# EAGLE design sumoboard (EAGLE 7.4.0)
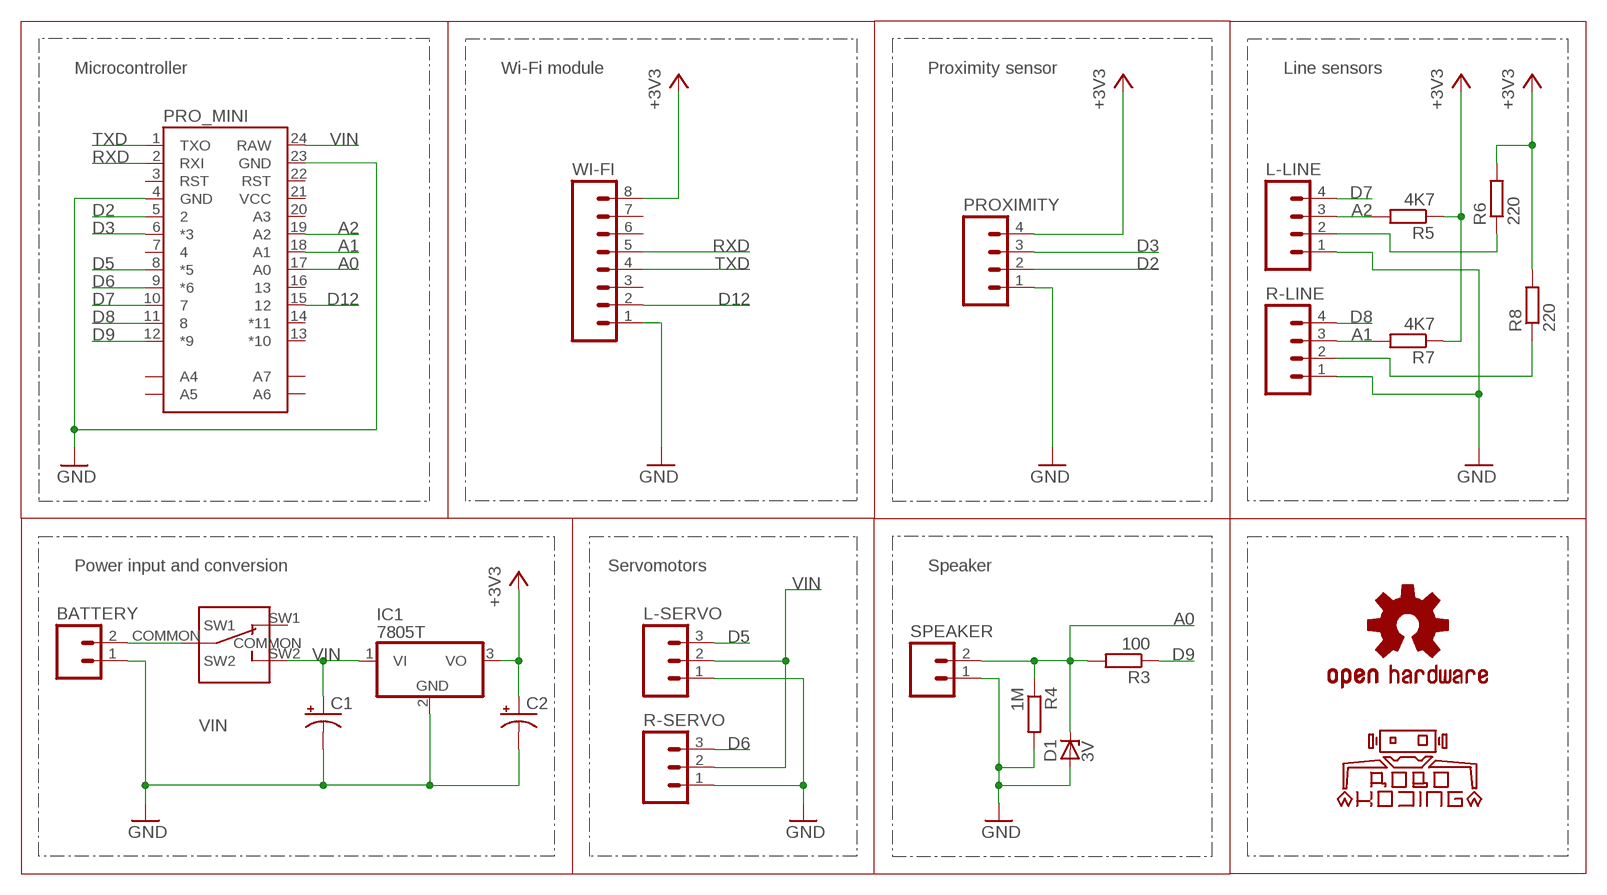
[diagram p0: schematic, sheet 1]

## Parts
BATTERY  M02LOCK_LONGPADS  [1X02_LOCK_LONGPADS]
C1  CPOL-USE5-10.5  [E5-10,5]
C2  CPOL-USE5-10.5  [E5-10,5]
D1  3V  1N821  [DO35Z10]
IC1  7805T  [TO220H]
L-LINE  M04LOCK_LONGPADS  [1X04_LOCK_LONGPADS]
L-SERVO  M03LOCK_LONGPADS  [1X03_LOCK_LONGPADS]
LOGO1  OSHW-LOGOM  [OSHW-LOGO-M]
LOGO2  ROBOKODING-LOGOM  [ROBOKODING-LOGO-M]
POWER  SPDT_SLIDE_SWITCH  [SPDT_SLIDE_SWITCH]
PRO_MINI  ARDUINO_PRO_MINI  [ARDUINO_PRO_MINI]
PROXIMITY  M04LOCK_LONGPADS  [1X04_LOCK_LONGPADS]
R3  100  R-EU_0204/5  [0204/5]
R4  1M  R-EU_0204/5  [0204/5]
R5  4K7  R-EU_0204/5  [0204/5]
R6  220  R-EU_0204/5  [0204/5]
R7  4K7  R-EU_0204/5  [0204/5]
R8  220  R-EU_0204/5  [0204/5]
R-LINE  M04LOCK_LONGPADS  [1X04_LOCK_LONGPADS]
R-SERVO  M03LOCK_LONGPADS  [1X03_LOCK_LONGPADS]
SPEAKER  M02LOCK_LONGPADS  [1X02_LOCK_LONGPADS]
WI-FI  M08LOCK_LONGPADS  [1X08_LOCK_LONGPADS]

## Nets
+3V3: C2.+ IC1.3(VO) PROXIMITY.4 R5.1 R6.2 R7.1 R8.2 WI-FI.8
A0: D1.C PRO_MINI.17(A0) R3.2 R4.1 SPEAKER.2
A1: PRO_MINI.18(A1) R7.2 R-LINE.3
A2: L-LINE.3 PRO_MINI.19(A2) R5.2
BAT_IN: BATTERY.2 POWER.COMMON
D2: PRO_MINI.5 PROXIMITY.2
D3: PRO_MINI.6(*3) PROXIMITY.3
D5: L-SERVO.3 PRO_MINI.8(*5)
D6: PRO_MINI.9(*6) R-SERVO.3
D7: L-LINE.4 PRO_MINI.10
D8: PRO_MINI.11 R-LINE.4
D9: PRO_MINI.12(*9) R3.1
D12: PRO_MINI.15 WI-FI.2
GND: BATTERY.1 C1.- C2.- D1.A IC1.2(GND) L-LINE.1 L-SERVO.1 PRO_MINI.4(GND) PRO_MINI.23(GND) PROXIMITY.1 R4.2 R-LINE.1 R-SERVO.1 SPEAKER.1 WI-FI.1
N$6: L-LINE.2 R6.1
N$7: R8.1 R-LINE.2
RXD: PRO_MINI.2(RXI) WI-FI.5
TXD: PRO_MINI.1(TXO) WI-FI.4
VIN: C1.+ IC1.1(VI) L-SERVO.2 POWER.SW2 PRO_MINI.24(RAW) R-SERVO.2
Unconnected: POWER.SW1 PRO_MINI.3(RST) PRO_MINI.7 PRO_MINI.13(*10) PRO_MINI.14(*11) PRO_MINI.16 PRO_MINI.20(A3) PRO_MINI.21(VCC) PRO_MINI.22(RST) WI-FI.3 WI-FI.6 WI-FI.7

## Notes on the sheet
- Microcontroller | Wi-Fi module | Proximity sensor | Line sensors
- Power input and conversion | Servomotors | Speaker

## Library data of the parts
BATTERY SPEAKER = SparkFun-Connectors:M02: Standard 2-pin 0.1" header. Use with - straight break away headers ( PRT-00116) - right angle break away headers (PRT-00553) - swiss pins (PRT-00743) - machine pins (PRT-00117) - female headers (PRT-00115) Molex polarized connector foot print use with: PRT-08233 with associated crimp pins and housings. 2.54_SCREWTERM for use with PRT-10571. 3.5mm Screw Terminal footprints for PRT-08084 5mm Screw Terminal footprints for use with PRT-08432
C1 C2 = rcl:CPOL-US: POLARIZED CAPACITOR, American symbol
D1 = diode:1N821: Reference DIODE temperature compensated, 6,2 V
IC1 = linear:78*: Positive VOLTAGE REGULATOR Source: http://cache.national.com/ds/LM/LM78L05.pdf http://www.fairchildsemi.com/ds/LM/LM7805.pdf
L-LINE PROXIMITY R-LINE = SparkFun-Connectors:M04: Header 4 Standard 4-pin 0.1" header. Use with straight break away headers (SKU : PRT-00116), right angle break away headers (PRT-00553), swiss pins (PRT-00743), machine pins (PRT-00117), and female headers (PRT-00115). Molex polarized connector foot print use with SKU : PRT-08231 with associated crimp pins and housings. 1MM SMD Version SKU: PRT-10208
L-SERVO R-SERVO = SparkFun-Connectors:M03: Header 3 Standard 3-pin 0.1" header. Use with straight break away headers (SKU : PRT-00116), right angle break away headers (PRT-00553), swiss pins (PRT-00743), machine pins (PRT-00117), and female headers (PRT-00115). Molex polarized connector foot print use with SKU : PRT-08232 with associated crimp pins and housings.
LOGO1 = SparkFun-Aesthetics:OSHW-LOGO: Open Source Hardware Logo This logo indicates the piece of hardware it is found on incorporates a OSHW license and/or adheres to the definition of open source hardware found here: http://freedomdefined.org/OSHW
LOGO2 = robokoding-logo:ROBOKODING-LOGO: Robokoding logo This logo indicates that the piece of hardware was developed by the RoboKoding community. RoboKoding is a organisation that focuses on teaching everyone building and programming robots: http://www.robokoding.com
POWER = custom:SPDT_SLIDE_SWITCH
PRO_MINI = SparkFun-Boards:ARDUINO_PRO_MINI
R3-R8 = Child-Friendly-Parts:R-EU_: RESISTOR, European symbol
WI-FI = SparkFun-Connectors:M08: Header 8 Standard 8-pin 0.1" header. Use with straight break away headers (SKU : PRT-00116), right angle break away headers (PRT-00553), swiss pins (PRT-00743), machine pins (PRT-00117), and female headers (PRT-00115).

## Board
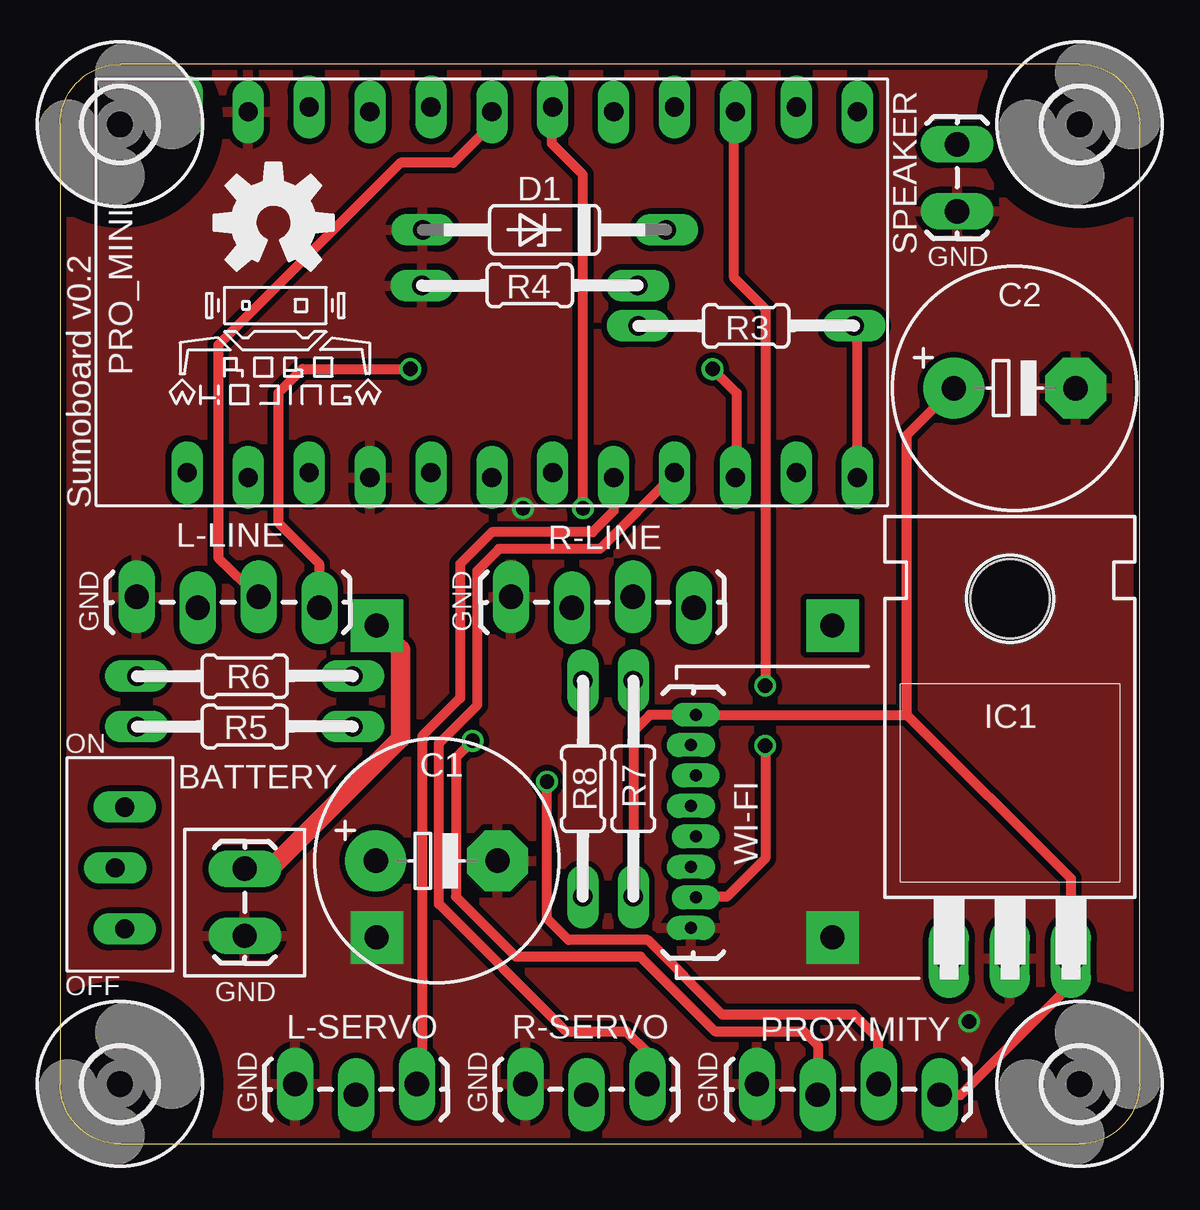
[diagram p1: board, top side]
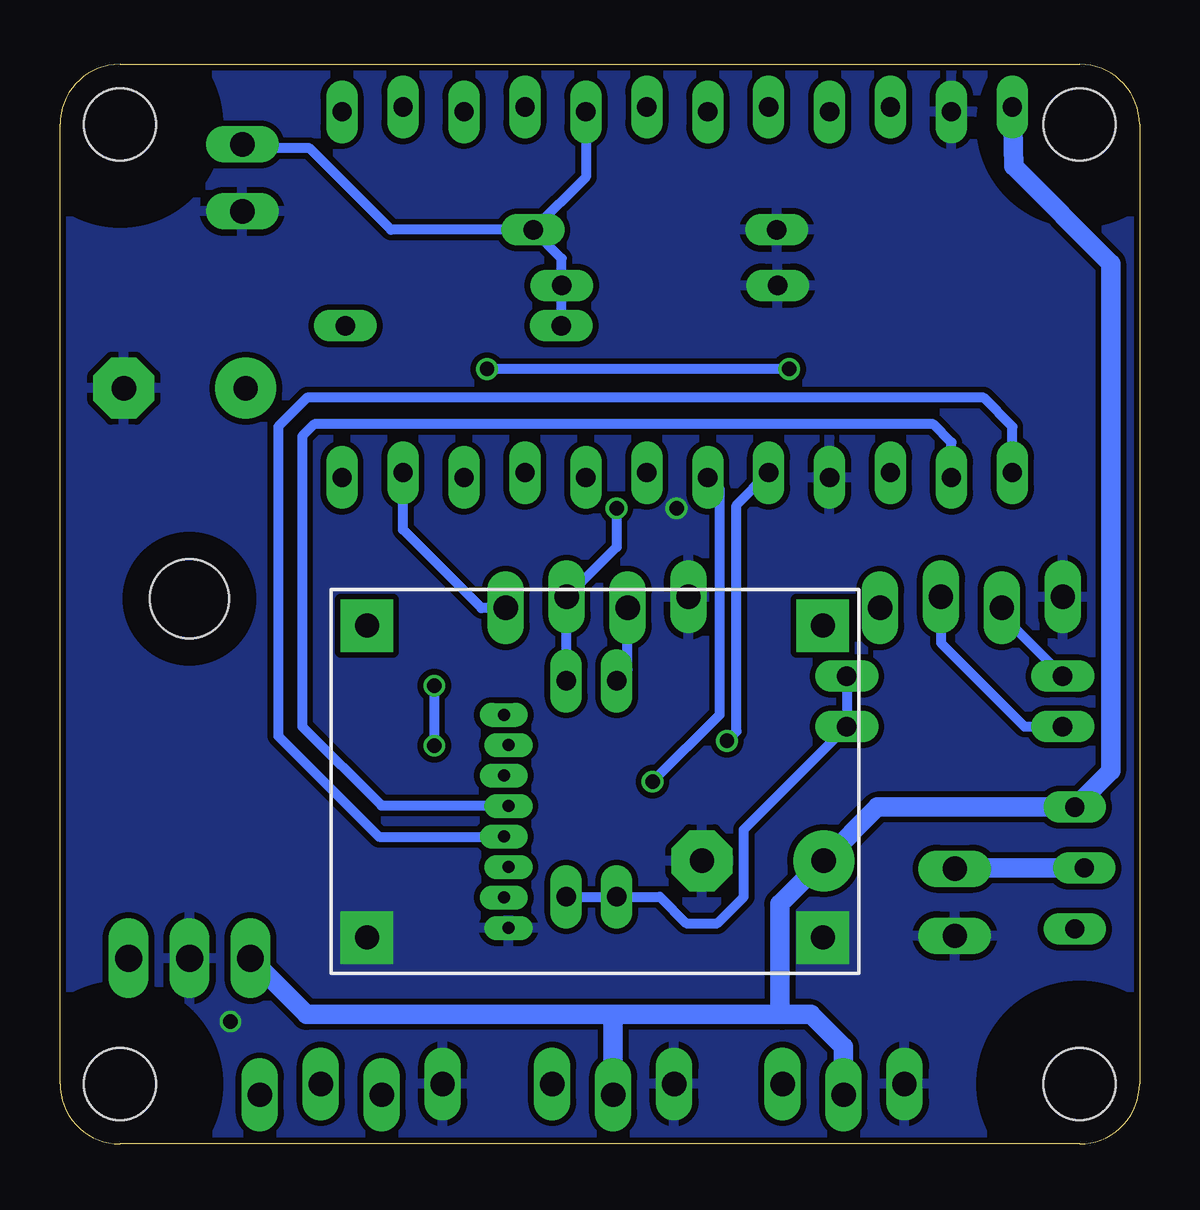
[diagram p2: board, bottom side, seen from below]

Size 45 x 45 mm. Coordinates in mm from the lower left corner, seen from the top.
Outline: 2.5,0 42.5,0 arc90 45,2.5 45,42.5 arc90 42.5,45 2.5,45 arc90 0,42.5 0,2.5 arc90 2.5,0
Copper layers (1*16): Top 0.035mm / dielectric 1.5mm / Bottom 0.035mm
Design rules "SeeedStudio_2layer_DRU_no_angle_20140221": minimum track width 6mil, minimum drill 12mil, track to track 6mil, track to pad 6mil, pad to pad 6mil, via to via 6mil, smd to smd 0mil, copper to edge 10mil, drill to drill 10mil, minimum pad ring 10mil, minimum via ring 6mil, stop-mask expansion 2mil, vias tented up to drill 100mil, thermal gap 10mil

### Footprints (pad centres in the part's own frame; a part is rotated, then mirrored left to right if it is on the bottom)
1X02_LOCK_LONGPADS = drill 1.016 long: 1 -0.127,0; 2 2.667,0
E5-10,5 = drill 1.016 pad 2.54: + -2.54,0 | drill 1.016 pad 2.54 octagon: - 2.54,0
DO35Z10 = drill 0.813 long: A 5.08,0; C -5.08,0
TO220H = drill 1.118 long: 1 -2.54,-10.16; 2 0,-10.16; 3 2.54,-10.16 | hole 3.302: 0,4.826
1X04_LOCK_LONGPADS = drill 1.016 long: 1 0,0.1; 2 2.54,-0.354; 3 5.08,0.1; 4 7.62,-0.354
1X03_LOCK_LONGPADS = drill 1.016 long: 1 0,0.1; 2 2.54,-0.354; 3 5.08,0.1
SPDT_SLIDE_SWITCH = drill 0.8 long: COMMON 0,0.2; SW1 -2.54,-0.2; SW2 2.54,-0.2
ARDUINO_PRO_MINI = drill 0.8 long: 1 -7.52,12.7; 2 -7.72,10.16; 3 -7.52,7.62; 4 -7.72,5.08; 5 -7.52,2.54; 6 -7.72,0; 7 -7.52,-2.54; 8 -7.72,-5.08; 9 -7.52,-7.62; 10 -7.72,-10.16; 11 -7.52,-12.7; 12 -7.72,-15.24; 13 7.52,-15.24; 14 7.72,-12.7; 15 7.52,-10.16; 16 7.72,-7.62; 17 7.52,-5.08; 18 7.72,-2.54; 19 7.52,0; 20 7.72,2.54; 21 7.52,5.08; 22 7.72,7.62; 23 7.52,10.16; 24 7.72,12.7
0204/5 = drill 0.813 long: 1 -4.5,0; 2 4.5,0
3,0 = hole 3: 0,0
1X08_LOCK_LONGPADS = drill 0.5 long: 1 0,0.1; 2 1.27,-0.1; 3 2.54,0.1; 4 3.81,-0.1; 5 5.08,0.1; 6 6.35,-0.1; 7 7.62,0.1; 8 8.89,-0.1

### Placement (x,y rotation side)
BATTERY  7.7,8.8 90 top
C1  15.7,11.8 0 top
C2  39.8,31.5 0 top
D1  20.2,38.1 180 top
IC1  39.6,17.9 0 top
L-LINE  3.2,22.7 0 top
L-SERVO  9.8,2.4 0 top
LOGO1  8.9,38.4 0 top
LOGO2  8.9,33.1 0 top
POWER  2.5,11.5 90 top
PRO_MINI  18,35.5 90 top
PROXIMITY  29.05,2.4 0 top
R3  28.6,34.1 180 top
R4  19.59,35.79 180 top
R5  7.7,17.4 180 top
R6  7.7,19.5 0 top
R7  23.9,14.8 90 top
R8  21.8,14.8 270 top
R-LINE  18.8,22.7 0 top
R-SERVO  19.4,2.4 0 top
SPEAKER  37.4,39 90 top
U$1  [3,0]  42.5,2.5 0 top
U$2  [3,0]  42.5,42.5 0 top
U$3  [3,0]  2.5,2.5 0 top
U$4  [3,0]  2.5,42.5 0 top
WI-FI  26.4,9 90 top

### Tracks (layer width: path | path; a pad name or v marks a point on that pad's centre or on a via)
+3V3
  Top 0.406: 35.31,17.89 WI-FI.8 24.59,17.89 23.9,17.2 R7.1 | 35.31,17.89 42.14,11.06 IC1.3 42.14,6.64 37.55,2.05 PROXIMITY.4 | 35.31,17.89 35.31,29.55 C2.+
  Bottom 0.406: R6.2 R5.1 16.5,13.1 16.5,10.3 17.6,9.2 18.9,9.2 20,10.3 R8.2 R7.1
A0
  Bottom 0.406: R3.2 24.1,35.77 R4.1 24.09,36.91 D1.C | PRO_MINI.17 23.08,40.3 D1.C | D1.C 31.2,38.1 34.6,41.5 36.33,41.5 SPEAKER.2
A1  (via drill 0.6)
  Top 0.406: v21.8,26.5 21.8,40.4 20.5,41.7 20.5,43.18 PRO_MINI.18
  Bottom 0.406: v21.8,26.5 21.8,24.87 R-LINE.3 23.9,22.78 R7.2
A2
  Top 0.406: PRO_MINI.19 18,42.5 16.4,40.9 14.2,40.9 6.6,33.3 6.6,24.43 L-LINE.3
  Bottom 0.406: L-LINE.3 8.28,20.88 4.8,17.4 R5.2
BAT_IN
  Bottom 0.813: POWER.COMMON 6.97,11.5 BATTERY.2
D2  (via drill 0.6)
  Top 0.406: PROXIMITY.2 31.6,2.36 31.6,4.1 31,4.7 27.3,4.7 24.2,7.8 19,7.8 16.5,10.3 16.5,16.1 v17.2,16.8
  Bottom 0.406: PRO_MINI.5 16.8,26.62 16.8,17.2 v17.2,16.8
D3  (via drill 0.6)
  Top 0.406: PROXIMITY.3 34.1,2.83 34.1,4.4 33.1,5.4 27.6,5.4 24.5,8.5 21.2,8.5 20.3,9.4 v20.3,15.1
  Bottom 0.406: PRO_MINI.6 17.5,27.28 17.5,17.9 v20.3,15.1
D5
  Top 0.406: PRO_MINI.8 23.08,26.38 22.2,25.5 18,25.5 16.68,24.18 16.68,18.58 15.1,17 15.1,2.72 L-SERVO.3
D6
  Top 0.406: PRO_MINI.9 25.62,27.92 22.5,24.8 18.3,24.8 17.4,23.9 17.4,18.3 15.8,16.7 15.8,10 21.1,4.7 23.6,4.7 24.48,3.82 R-SERVO.3
D7  (via drill 0.6)
  Top 0.406: v14.6,32.3 10.1,32.3 9.1,31.3 9.1,25.9 10.8,24.2 10.8,22.32 L-LINE.4 | v27.2,32.3 28.2,31.3 28.2,27.82 PRO_MINI.10
  Bottom 0.406: v14.6,32.3 v27.2,32.3
D8
  Bottom 0.406: R-LINE.4 27.44,22.34 30.7,25.6 PRO_MINI.11
D9
  Top 0.406: PRO_MINI.12 33.24,33.96 R3.1
D12  (via drill 0.6)
  Top 0.406: PRO_MINI.15 28.1,42.96 28.1,36.1 29.4,34.8 v29.4,19.1 | v29.4,16.6 29.4,11.9 27.8,10.3 26.53,10.3 WI-FI.2
  Bottom 0.406: v29.4,19.1 v29.4,16.6
GND  (via drill 0.6, 1 pad 2.18)
  other vias: 19.3,26.5 37.9,5.1 13.2,8.6 32.2,8.6
  pour Top (isolate 0.24): 0,45 45.1,45 45.1,0 0,0
  pour Bottom (isolate 0.24): 0,45 45,45 45,0 0,0
N$1  (via drill 1 pad 2.18)
  Top 0.813: v13.2,21.6 14.2,20.6 14.2,16.9 8.7,11.4 7.7,11.4
N$2  (via drill 1 pad 2.18)
  other vias: 32.2,21.6
N$6
  Bottom 0.406: L-LINE.2 5.74,22.04 R6.1
N$7
  Bottom 0.406: R8.1 21.34,19.76 R-LINE.2
RXD
  Bottom 0.406: PRO_MINI.2 7.84,29.24 8.6,30 34.4,30 34.9,29.5 34.9,17.4 31.6,14.1 26.32,14.1 WI-FI.5
TXD
  Bottom 0.406: PRO_MINI.1 5.3,29.9 6.5,31.1 34.7,31.1 35.9,29.9 35.9,17 31.7,12.8 WI-FI.4
VIN
  Bottom 0.813: PRO_MINI.24 5.25,40.75 1.2,36.7 1.2,15.54 POWER.SW2 10.92,14.04 C1.+ 13.2,11.8 15,10 15,5.5 14.9,5.4 | 14.9,5.4 13.7,5.4 12.34,4.04 L-SERVO.2 | 14.9,5.4 21.94,5.4 | 21.94,5.4 34.72,5.4 IC1.1 | 21.94,5.4 R-SERVO.2

### Text on the board
tPlace: GND | Sumoboard v0.2 | GND | GND | ON | OFF | GND | GND | GND | GND